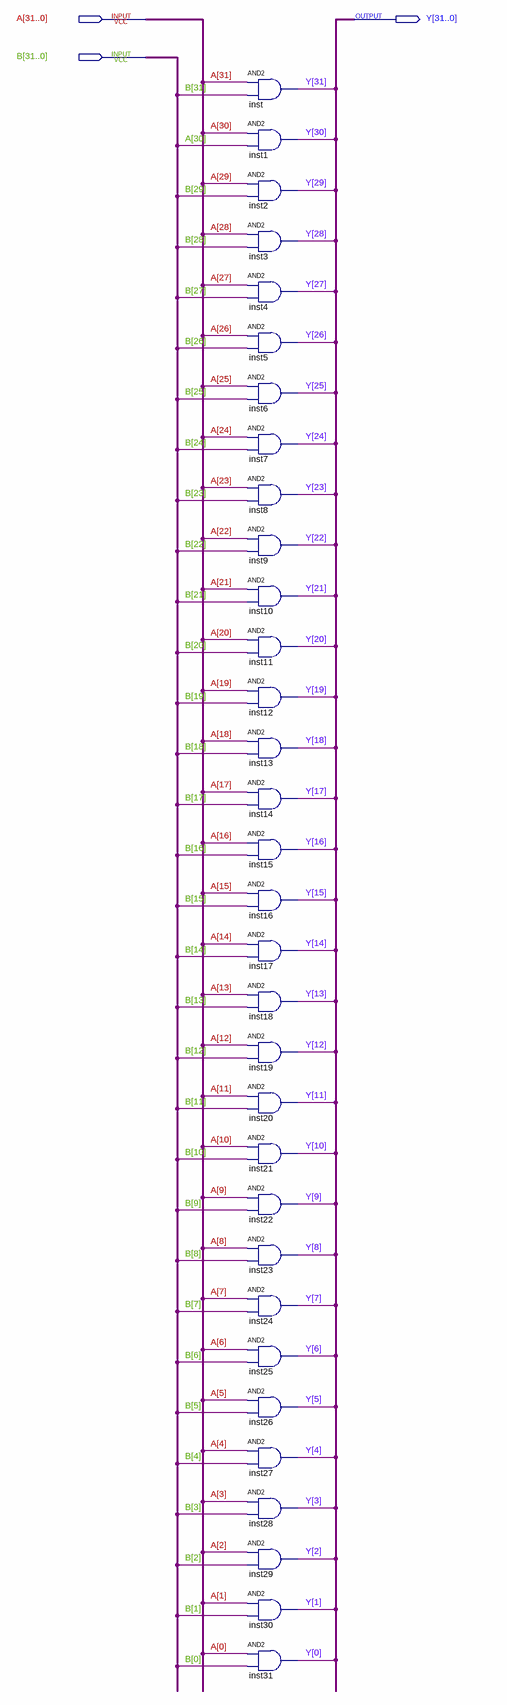
[diagram p0: schematic sheet]
// Quartus schematic AND_32.bdf as structural Verilog: 32 symbols, 3 pins
module AND_32 (
  input  [31:0] A,
  input  [31:0] B,
  output [31:0] Y
);

  and inst (Y[31], A[31], B[31]);
  and inst1 (Y[30], A[30], A[30]);
  and inst2 (Y[29], A[29], B[29]);
  and inst3 (Y[28], A[28], B[28]);
  and inst4 (Y[27], A[27], B[27]);
  and inst5 (Y[26], A[26], B[26]);
  and inst6 (Y[25], A[25], B[25]);
  and inst7 (Y[24], A[24], B[24]);
  and inst8 (Y[23], A[23], B[23]);
  and inst9 (Y[22], A[22], B[22]);
  and inst10 (Y[21], A[21], B[21]);
  and inst11 (Y[20], A[20], B[20]);
  and inst12 (Y[19], A[19], B[19]);
  and inst13 (Y[18], A[18], B[18]);
  and inst14 (Y[17], A[17], B[17]);
  and inst15 (Y[16], A[16], B[16]);
  and inst16 (Y[15], A[15], B[15]);
  and inst17 (Y[14], A[14], B[14]);
  and inst18 (Y[13], A[13], B[13]);
  and inst19 (Y[12], A[12], B[12]);
  and inst20 (Y[11], A[11], B[11]);
  and inst21 (Y[10], A[10], B[10]);
  and inst22 (Y[9], A[9], B[9]);
  and inst23 (Y[8], A[8], B[8]);
  and inst24 (Y[7], A[7], B[7]);
  and inst25 (Y[6], A[6], B[6]);
  and inst26 (Y[5], A[5], B[5]);
  and inst27 (Y[4], A[4], B[4]);
  and inst28 (Y[3], A[3], B[3]);
  and inst29 (Y[2], A[2], B[2]);
  and inst30 (Y[1], A[1], B[1]);
  and inst31 (Y[0], A[0], B[0]);
endmodule
